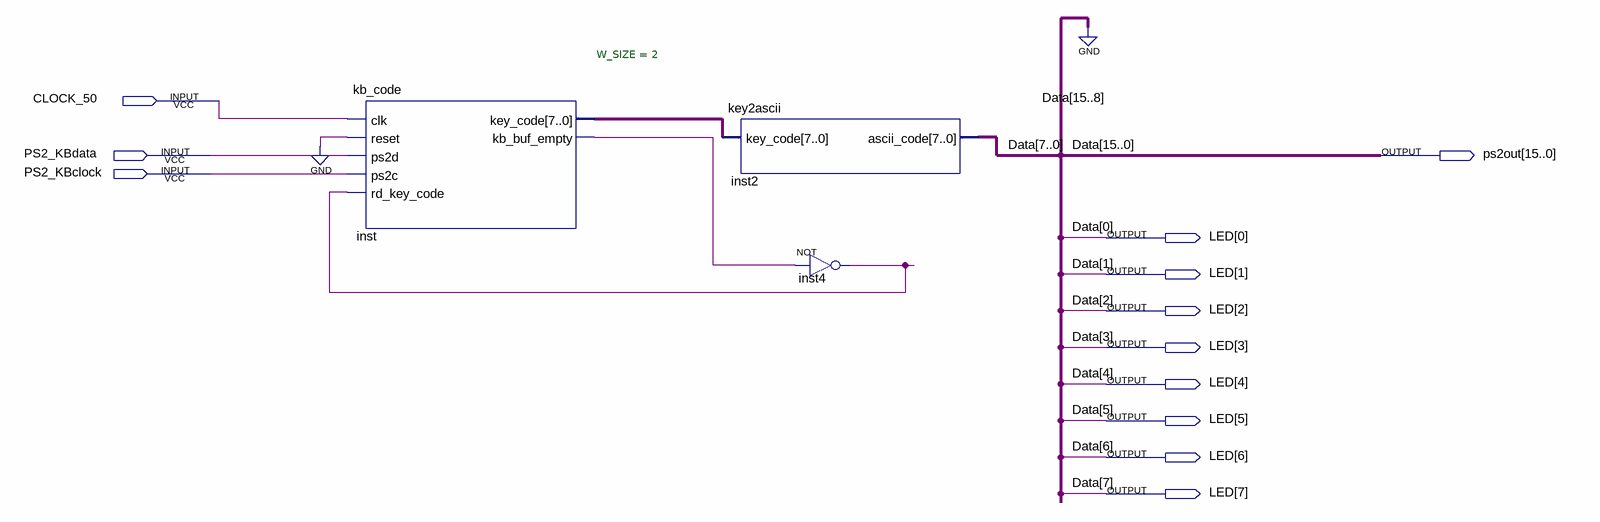
[diagram p0: schematic sheet]
// Quartus schematic PS2.bdf as structural Verilog: 3 symbols, 12 pins
module PS2 (
  input  CLOCK_50,
  input  PS2_KBdata,
  input  PS2_KBclock,
  output [15:0] ps2out,
  output [7:0] LED
);

  wire inst4_out, inst_kb_buf_empty;
  wire [7:0] inst_key_code;

  kb_code #(.W_SIZE(2)) inst (
    .clk(CLOCK_50), .reset(1'b0), .ps2d(PS2_KBdata), .ps2c(PS2_KBclock), .rd_key_code(inst4_out),
    .key_code(inst_key_code), .kb_buf_empty(inst_kb_buf_empty));
  key2ascii inst2 (.key_code(inst_key_code), .ascii_code(LED));
  not inst4 (inst4_out, inst_kb_buf_empty);

  assign ps2out = {{8{1'b0}}, LED};

  // Other names for the same wires on the sheet: Data[7:0] = LED
endmodule
